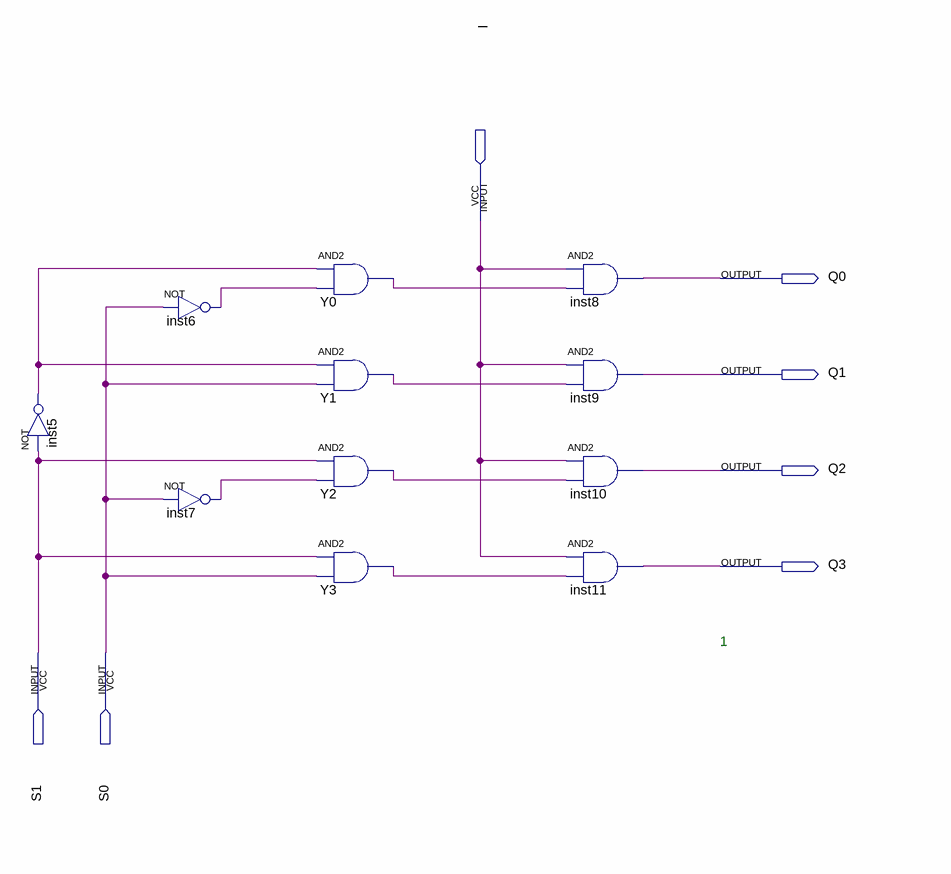
[diagram p0: schematic sheet]
// Quartus schematic 1131417_Lab1-4.bdf as structural Verilog: 11 symbols, 7 pins
module \1131417_Lab1-4  (
  input  I,
  input  S1,
  input  S0,
  output Q0,
  output Q1,
  output Q2,
  output Q3
);

  wire inst5_out, inst6_out, inst7_out, Y0_out, Y1_out, Y2_out, Y3_out;

  not inst5 (inst5_out, S1);
  not inst6 (inst6_out, S0);
  not inst7 (inst7_out, S0);
  and Y0 (Y0_out, inst5_out, inst6_out);
  and Y1 (Y1_out, inst5_out, S0);
  and Y2 (Y2_out, S1, inst7_out);
  and Y3 (Y3_out, S1, S0);
  and inst8 (Q0, I, Y0_out);
  and inst9 (Q1, I, Y1_out);
  and inst10 (Q2, I, Y2_out);
  and inst11 (Q3, I, Y3_out);

  // Notes on the sheet:
  //   1
endmodule
